# Altium schematic sheet Mcu.SchDoc
size A2
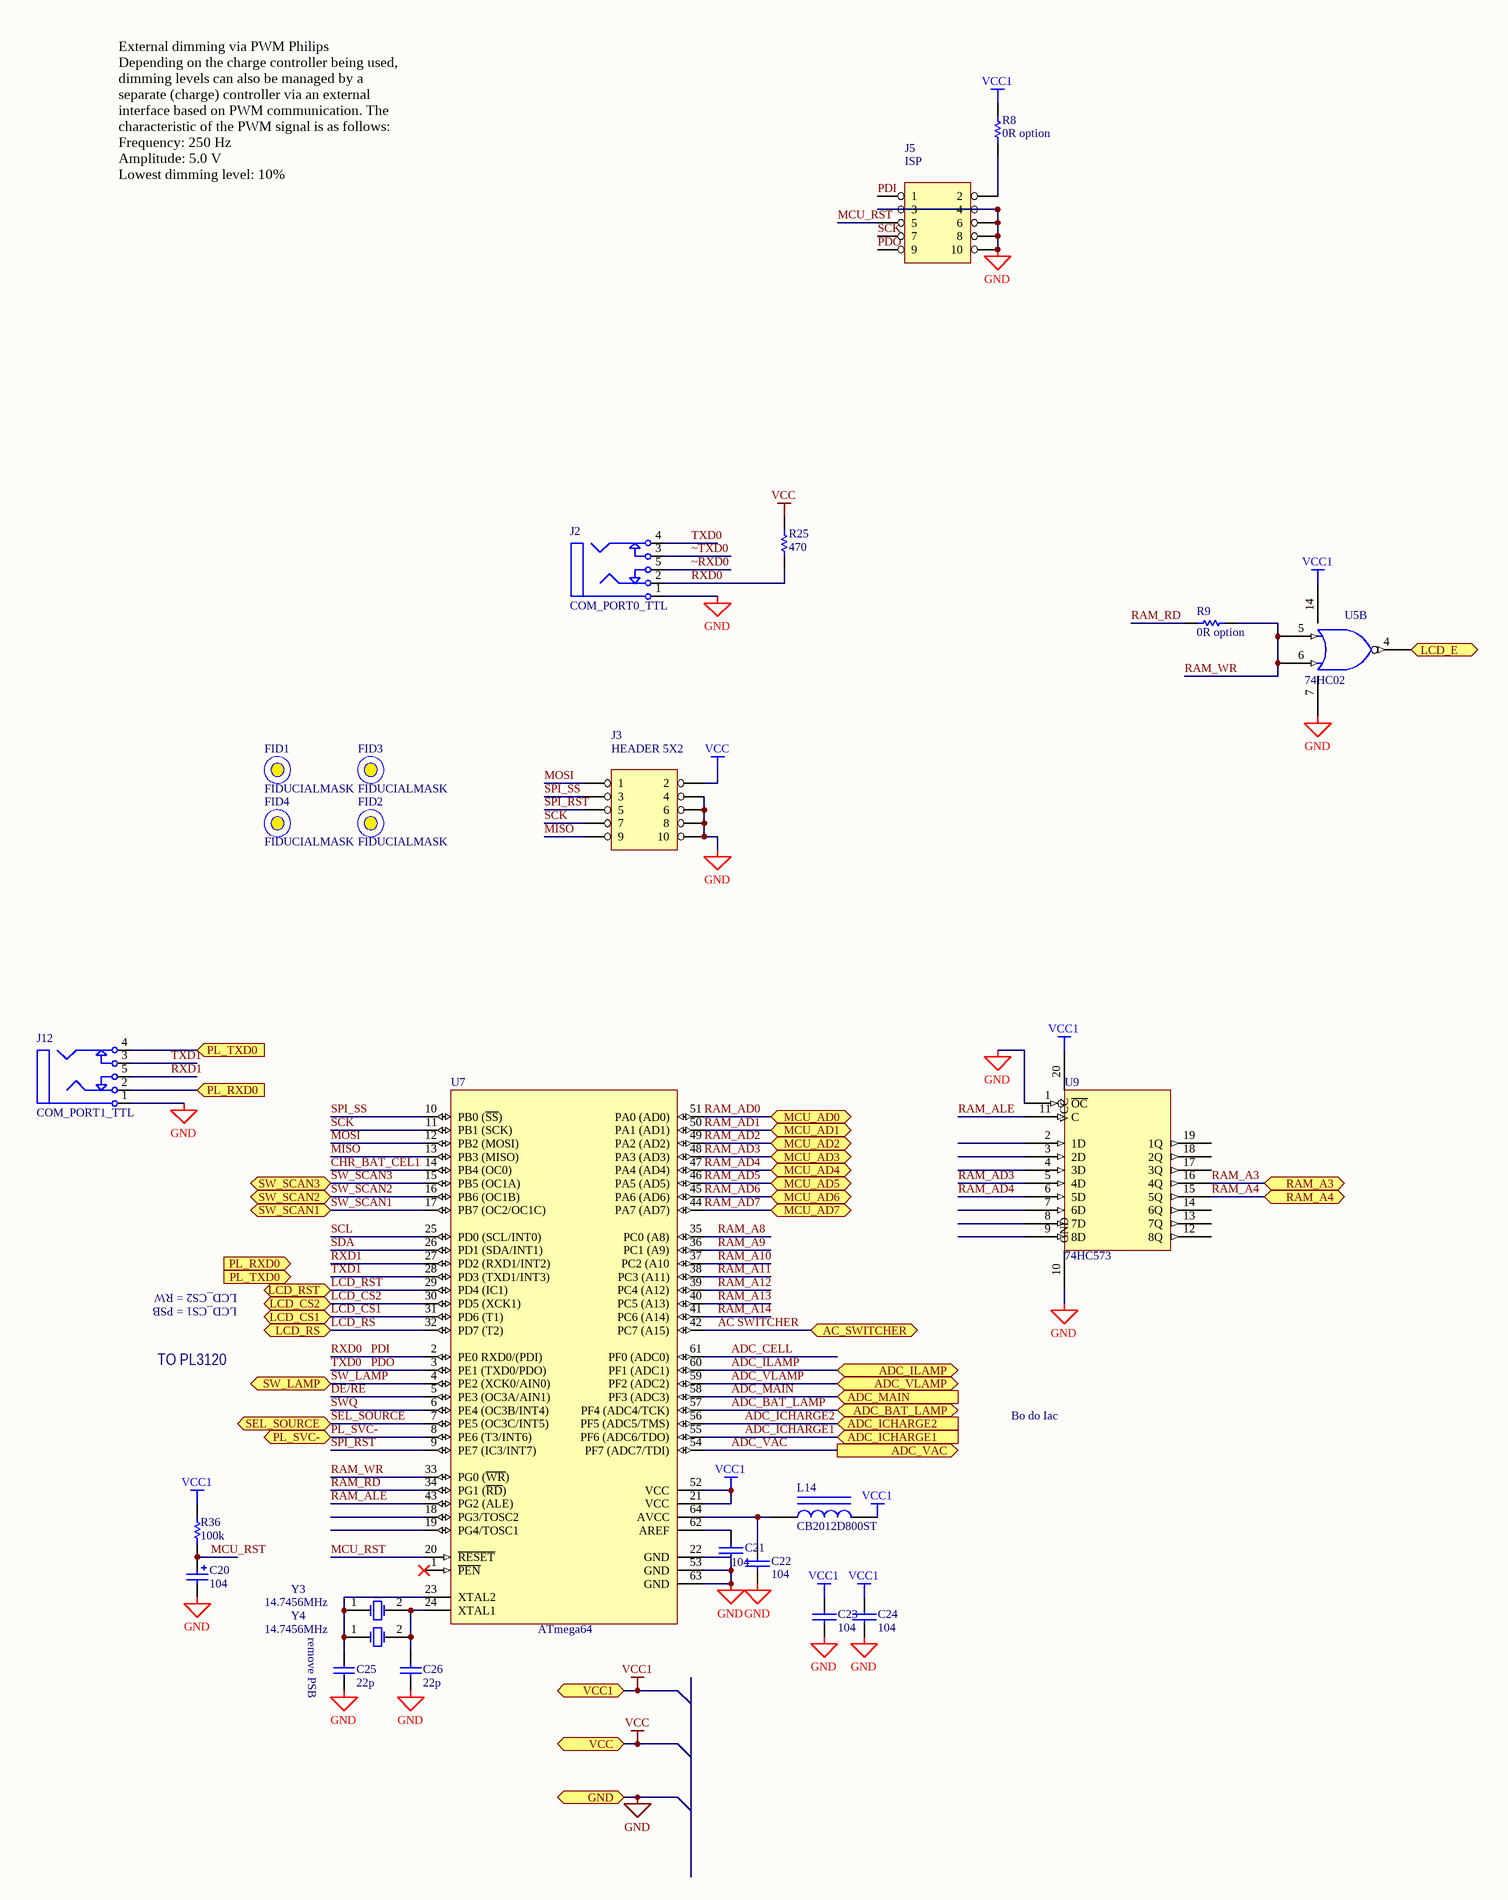
[diagram p0: Mcu.SchDoc, left]
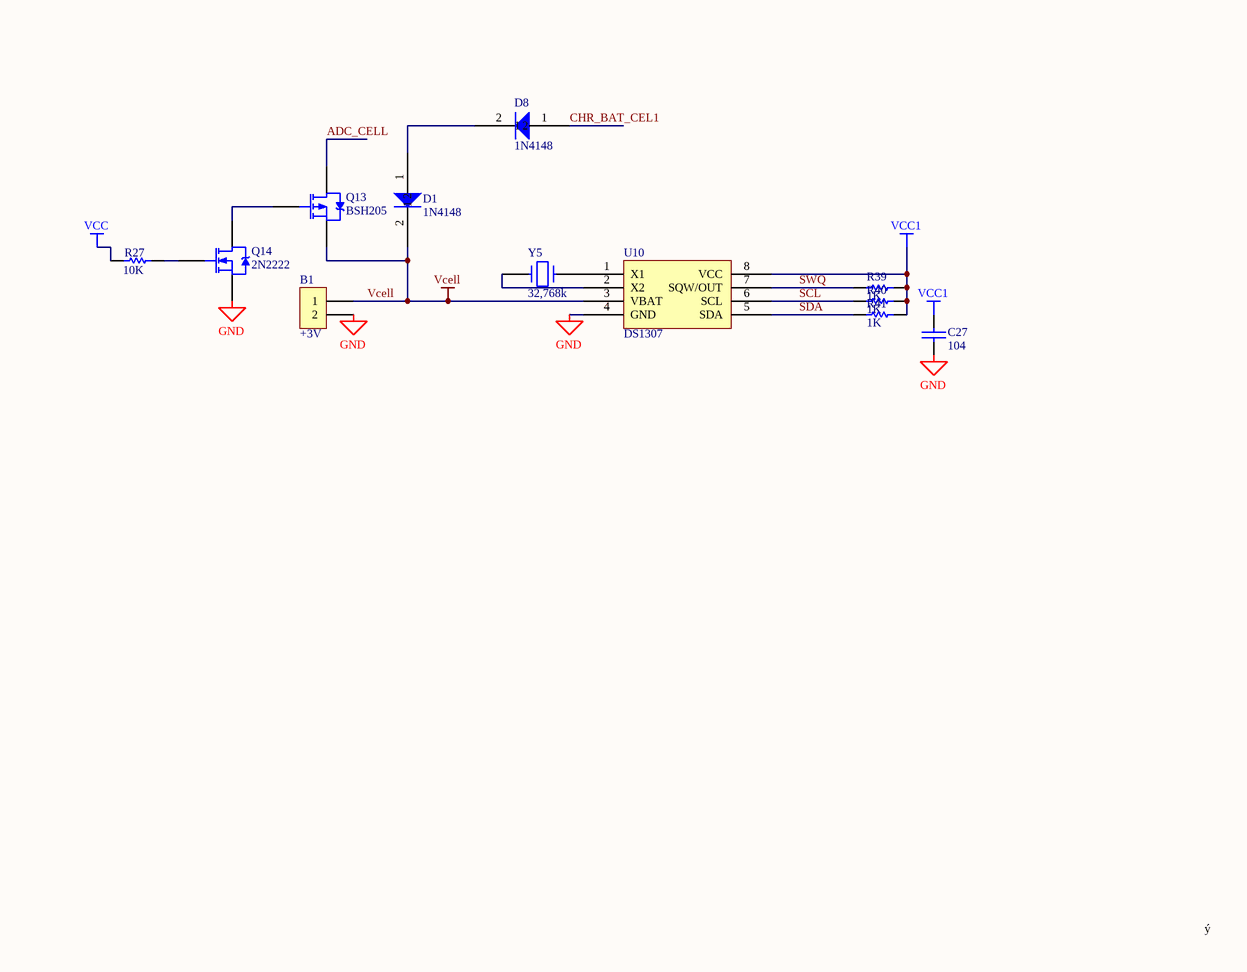
[diagram p1: Mcu.SchDoc, right]

## Parts
B1  +3V  [NI-MH-3V6]
C20  104  [C6-0805_N]
C21  104  [C6-0805_N]
C22  104  [C6-0805_N]
C23  104  [C6-0805_N]
C24  104  [C6-0805_N]
C25  22p  [C6-0805_N]
C26  22p  [C6-0805_N]
C27  104  [C6-0805_N]
D1  1N4148  [SOD80, LL-34]
D8  1N4148  [SOD80, LL-34]
FID1  FIDUCIALMASK  [FIDUCIALMASK]
FID2  FIDUCIALMASK  [FIDUCIALMASK]
FID3  FIDUCIALMASK  [FIDUCIALMASK]
FID4  FIDUCIALMASK  [FIDUCIALMASK]
J2  COM_PORT0_TTL  [SJ-3515]
J3  HEADER 5X2  [10P_PCB_HEADER_BRD_MNT]
J5  ISP  [10P_PCB_HEADER_BRD_MNT]
J12  COM_PORT1_TTL  [SJ-3515]
L14  CB2012D800ST  [R6-0805_N]
Q13  BSH205  [SOT23-3]
Q14  2N2222  [SOT23-3]
R8  0R option  [JP2]
R9  0R option  [6-0805_N]
R25  470  [6-0805_N]
R27  10K  [6-0805_N]
R36  100k  [6-0805_N]
R39  1K  [6-0805_N]
R40  1K  [6-0805_N]
R41  1K  [6-0805_N]
U5  74HC02  [SOIC127P600X175-14AN]  (part B of 4)
U7  ATmega64  [QFP64-3]
U9  74HC573  [SOIC127P1041-20L]
U10  DS1307  [M08A_N]
Y3  14.7456MHz  [XTAL]
Y4  14.7456MHz  [CRYSTAL_HC49-US-SM]
Y5  32,768k  [R38]

## Ports
AC_SWITCHER, ADC_BAT_LAMP, ADC_ICHARGE1, ADC_ICHARGE2, ADC_ILAMP, ADC_MAIN, ADC_VAC, ADC_VLAMP, GND, LCD_CS1, LCD_CS2, LCD_E, LCD_RS, LCD_RST, MCU_AD0, MCU_AD1, MCU_AD2, MCU_AD3, MCU_AD4, MCU_AD5, MCU_AD6, MCU_AD7, PL_RXD0, PL_SVC-, PL_TXD0, RAM_A3, RAM_A4, SEL_SOURCE, SW_LAMP, SW_SCAN1, SW_SCAN2, SW_SCAN3, VCC, VCC1

## Nets
GND: B1.2 C20.2 C21.2 C22.1 C23.2 C24.2 C25.1 C26.1 C27.2 J2.1 J3.4 J3.6 J3.8 J3.10 J5.3 J5.4 J5.6 J5.8 J5.10 J12.1 Q14.2(S) U5.7(GND) U7.22(GND) U7.53(GND) U7.63(GND) U9.1(~{OC}) U9.10(GND) U10.4(GND) ; port GND
VCC: J3.2 R25.1 R27.2 ; port VCC
VCC1: C23.1 C24.1 C27.1 L14.1 R8.1 R36.2 R39.2 R40.2 R41.2 U5.14(VCC) U7.21(VCC) U7.52(VCC) U9.20(VCC) U10.8(VCC) ; port VCC1
Vcell: B1.1 D1.2 Q13.2(S) U10.3(VBAT)
AC SWITCHER: U7.42(PC7_(A15)) ; port AC_SWITCHER
ADC_BAT_LAMP: U7.57(PF4_(ADC4/TCK)) ; port ADC_BAT_LAMP
ADC_CELL: Q13.3(D) U7.61(PF0_(ADC0))
ADC_ICHARGE1: U7.55(PF6_(ADC6/TDO)) ; port ADC_ICHARGE1
ADC_ICHARGE2: U7.56(PF5_(ADC5/TMS)) ; port ADC_ICHARGE2
ADC_ILAMP: U7.60(PF1_(ADC1)) ; port ADC_ILAMP
ADC_MAIN: U7.58(PF3_(ADC3)) ; port ADC_MAIN
ADC_VAC: U7.54(PF7_(ADC7/TDI)) ; port ADC_VAC
ADC_VLAMP: U7.59(PF2_(ADC2)) ; port ADC_VLAMP
CHR_BAT_CEL1: D8.1 U7.14(PB4_(OC0))
DE/RE: U7.5(PE3_(OC3A/AIN1))
LCD_CS1: U7.31(PD6_(T1)) ; port LCD_CS1
LCD_CS2: U7.30(PD5_(XCK1)) ; port LCD_CS2
LCD_E: U5.4 ; port LCD_E
LCD_RS: U7.32(PD7_(T2)) ; port LCD_RS
LCD_RST: U7.29(PD4_(IC1)) ; port LCD_RST
MCU_RST: C20.1 J5.5 R36.1 U7.20(~{RESET})
MISO: J3.9 U7.13(PB3_(MISO))
MOSI: J3.1 U7.12(PB2_(MOSI))
PDI: J2.2 J5.1 R25.2 U7.2(PE0_RXD0/(PDI))  [also labelled RXD0]
PDO: J2.4 J5.9 U7.3(PE1_(TXD0/PDO))  [also labelled TXD0]
PL_RXD0: J12.2 ; port PL_RXD0
PL_SVC-: U7.8(PE6_(T3/INT6)) ; port PL_SVC-
PL_TXD0: J12.4 ; port PL_TXD0
RAM_A3: U9.16(4Q) ; port RAM_A3
RAM_A4: U9.15(5Q) ; port RAM_A4
RAM_A8: U7.35(PC0_(A8))
RAM_A9: U7.36(PC1_(A9))
RAM_A10: U7.37(PC2_(A10)
RAM_A11: U7.38(PC3_(A11))
RAM_A12: U7.39(PC4_(A12))
RAM_A13: U7.40(PC5_(A13))
RAM_A14: U7.41(PC6_(A14))
RAM_AD0: U7.51(PA0_(AD0)) ; port MCU_AD0
RAM_AD1: U7.50(PA1_(AD1)) ; port MCU_AD1
RAM_AD2: U7.49(PA2_(AD2)) ; port MCU_AD2
RAM_AD3: U7.48(PA3_(AD3)) U9.5(4D) ; port MCU_AD3
RAM_AD4: U7.47(PA4_(AD4)) U9.6(5D) ; port MCU_AD4
RAM_AD5: U7.46(PA5_(AD5)) ; port MCU_AD5
RAM_AD6: U7.45(PA6_(AD6)) ; port MCU_AD6
RAM_AD7: U7.44(PA7_(AD7)) ; port MCU_AD7
RAM_ALE: U7.43(PG2_(ALE)) U9.11(C)
RAM_RD: R9.1 U7.34(PG1_(~{RD}))
RAM_WR: R9.2 U5.5 U5.6 U7.33(PG0_(~{WR}))
RXD1: J12.5 U7.27(PD2_(RXD1/INT2))
SCK: J3.7 J5.7 U7.11(PB1_(SCK))
SCL: R40.1 U7.25(PD0_(SCL/INT0)) U10.6(SCL)
SDA: R41.1 U7.26(PD1_(SDA/INT1)) U10.5(SDA)
SEL_SOURCE: U7.7(PE5_(OC3C/INT5)) ; port SEL_SOURCE
SPI_RST: J3.5 U7.9(PE7_(IC3/INT7))
SPI_SS: J3.3 U7.10(PB0_(~{SS}))
SW_LAMP: U7.4(PE2_(XCK0/AIN0)) ; port SW_LAMP
SW_SCAN1: U7.17(PB7_(OC2/OC1C)) ; port SW_SCAN1
SW_SCAN2: U7.16(PB6_(OC1B)) ; port SW_SCAN2
SW_SCAN3: U7.15(PB5_(OC1A)) ; port SW_SCAN3
SWQ: R39.1 U7.6(PE4_(OC3B/INT4)) U10.7(SQW/OUT)
TXD1: J12.3 U7.28(PD3_(TXD1/INT3))
~RXD0: J2.5
~TXD0: J2.3
NetC21_1: C21.1 U7.62(AREF)
NetC22_2: C22.2 L14.2 U7.64(AVCC)
NetC25_2: C25.2 U7.23(XTAL2) Y3.1(OSC1) Y4.1(OSC1)
NetC26_2: C26.2 U7.24(XTAL1) Y3.2(OSC2) Y4.2(OSC2)
NetD1_1: D1.1 D8.2
NetJ5_2: J5.2 R8.2
NetQ13_1: Q13.1(G) Q14.3(D)
NetQ14_1: Q14.1(G) R27.1
NetU10_1: U10.1(X1) Y5.1
NetU10_2: U10.2(X2) Y5.2

Not connected (* = marked no-connect by the designer): J2 1A 1B 2A 2B 3A 3B 4A 4B 5A 5B; J12 1A 1B 2A 2B 3A 3B 4A 4B 5A 5B; U7 1(~{PEN})* 18(PG3/TOSC2) 19(PG4/TOSC1); U9 2(1D) 3(2D) 4(3D) 7(6D) 8(7D) 9(8D) 12(8Q) 13(7Q) 14(6Q) 17(3Q) 18(2Q) 19(1Q)

## Notes on the sheet
- External dimming via PWM Philips
  Depending on the charge controller being used, dimming levels can also be managed by a
  separate (charge) controller via an external interface based on PWM communication. The
  characteristic of the PWM signal is as follows:
  Frequency: 250 Hz
  Amplitude: 5.0 V
  Lowest dimming level: 10%
- LCD_CS1 = PSB
- LCD_CS2 = RW
- TO PL3120
- Bo do Iac
- (near C25) remove PSB
- ý

## Library data of the parts
B1 = CON2: Ni-Mh 3v6 chargable
C20 = Cap Pol1: Polarized Capacitor (Radial); Published: *; LatestRevisionDate: *; LatestRevisionNote: *; PackageReference: *; Publisher: *; Value: *
C21-C24 C27 = CAP: Capacitor
C25 C26 = Cap: Capacitor; Value: 22 pF; Published: 8-Jun-2000; LatestRevisionDate: 17-Jul-2002; LatestRevisionNote: Re-released for DXP Platform.; PackageReference: RAD-0.3; Publisher: Altium Limited
D1 D8 = DIODE: pin to pad: 1>A 2>K
J2 J12 = Phonejack Stereo SW: 3-Conductor Jack with 2 break contacts (normals) and 2 auxiliary make contacts; Published: 5-Jan-2004; LatestRevisionDate: 17-Dec-2003; LatestRevisionNote: PCB Footprint replaced.; DatasheetDocument: 07-Mar-2000; Publisher: Altium Limited; ComponentLink1Description: Manufacturer Link; ComponentLink1URL: http://domino.kycon.com/internet/Products.html
J5 = HEADER 5X2
L14 = INDUCTOR IRON: 80 Ohm SMD-0805 Chip Ferrite Bead
Q13 = PMOS-2: P Mosfet transistor, input Logic level, Fast switching, 12V - 750mA; Note: Pin 4 not drawn and electrically connected to Pin 2.; Published: 8-Jun-2000; LatestRevisionDate: 17-Jul-2002; LatestRevisionNote: Re-released for DXP Platform.; DatasheetVersion: PD-9.390D; PackageVersion: Feb-1997; PackageReference: TO-220AB; Publisher: Altium Limited; PackageDescription: TO, Thru-Hole, Vertical, Heatsink Mounted; 3 In-Line Leads; Pitch 2.54 mm; ComponentLink1Description: Manufacturer Link; ComponentLink1URL: http://www.irf.com/
Q14 = NMOS-2: N-Channel Power MOSFET; Note: Pin 2 is electrically connected to pin 4.; Published: 8-Jun-2000; LatestRevisionDate: 17-Jul-2002; LatestRevisionNote: Re-released for DXP Platform.; DatasheetVersion: PD-9.814; PackageVersion: Feb-1997; PackageReference: TO-220AB; Publisher: Altium Limited; PackageDescription: TO, Thru-Hole, Vertical, Heatsink Mounted; 3 In-Line Leads; Pitch 2.54 mm; ComponentLink1Description: Manufacturer Link; ComponentLink1URL: http://www.irf.com/
R8 R9 = Res Semi: Published: *; LatestRevisionDate: *; LatestRevisionNote: *; PackageReference: *; Publisher: *; Value: *
R25 R27 R36 R39-R41 = Res Semi: Semiconductor Resistor; Published: *; LatestRevisionDate: *; LatestRevisionNote: *; PackageReference: *; Publisher: *; Value: *
U5 = 74LS02
U7 = ATmega64-16AC: 8-Bit AVR Microcontroller with 64K Bytes of In-System Programmable Flash Memory; Published: 17-Sep-2003; LatestRevisionDate: 13-Apr-2006; LatestRevisionNote: IPC-7351 Footprint Added.; DatasheetVersion: 2490C-AVR-009/02; PackageVersion: revB, Oct-2001; PackageReference: 64A; Publisher: Altium Limited; PackageDescription: 64-Pin Thin Quad Flat Pack 0.8 mm Pitch; Code_JEDEC: MS-026-AEB; ComponentLink1Description: Manufacturer Link; ComponentLink1URL: http://www.atmel.com; ComponentLink2Description: Datasheet; ComponentLink2URL: http://www.atmel.com/dyn/resources/prod_documents/doc2490.pdf
Y3 Y4 = XTAL: Crystal Oscillator; Published: 8-Jun-2000; LatestRevisionDate: 17-Jul-2002; LatestRevisionNote: Re-released for DXP Platform.; PackageReference: R38; Publisher: Altium Limited
Y5 = CRYSTAL